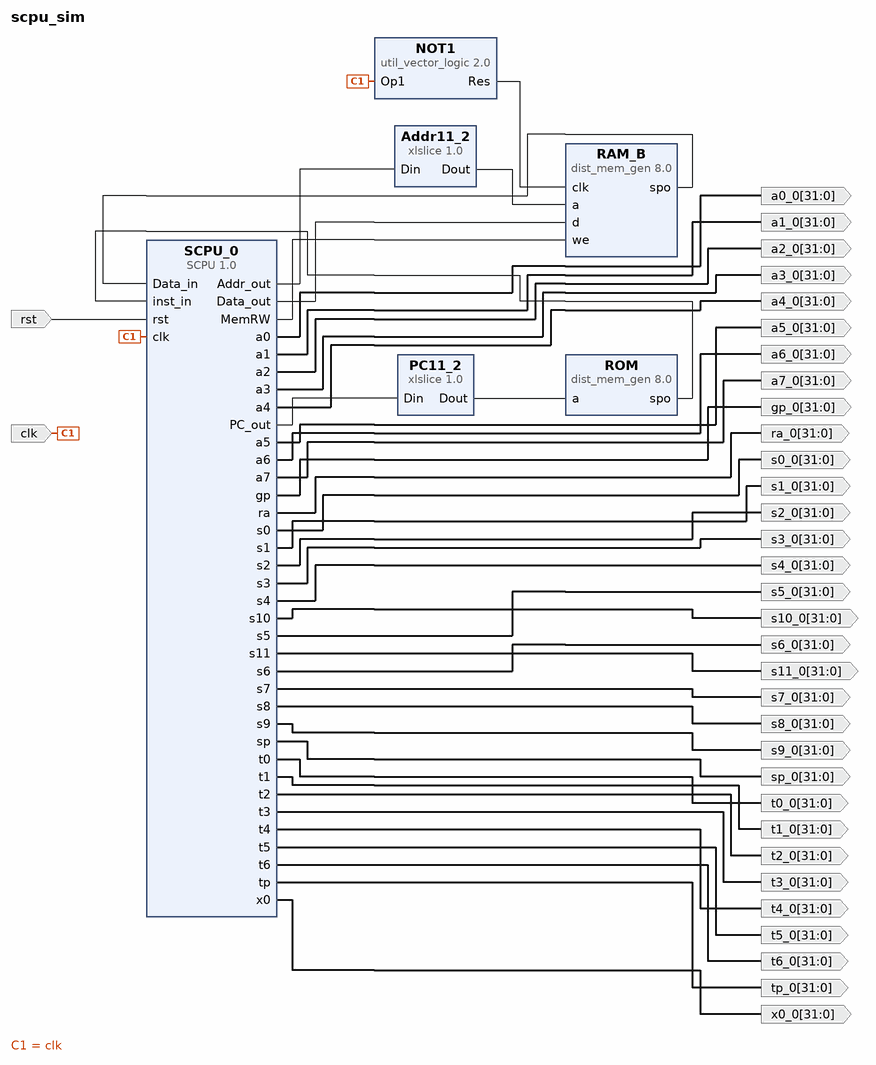
[diagram p0: block diagram of the top level]
# Vivado block design scpu_sim, xc7k160tffg676-2L, Vivado 2017.4
create_bd_design scpu_sim

create_bd_port -dir I -type clk clk
create_bd_port -dir I -type rst rst
create_bd_port -dir O -from 31 -to 0 a0_0
create_bd_port -dir O -from 31 -to 0 a1_0
create_bd_port -dir O -from 31 -to 0 a2_0
create_bd_port -dir O -from 31 -to 0 a3_0
create_bd_port -dir O -from 31 -to 0 a4_0
create_bd_port -dir O -from 31 -to 0 a5_0
create_bd_port -dir O -from 31 -to 0 a6_0
create_bd_port -dir O -from 31 -to 0 a7_0
create_bd_port -dir O -from 31 -to 0 gp_0
create_bd_port -dir O -from 31 -to 0 ra_0
create_bd_port -dir O -from 31 -to 0 s0_0
create_bd_port -dir O -from 31 -to 0 s1_0
create_bd_port -dir O -from 31 -to 0 s10_0
create_bd_port -dir O -from 31 -to 0 s11_0
create_bd_port -dir O -from 31 -to 0 s2_0
create_bd_port -dir O -from 31 -to 0 s3_0
create_bd_port -dir O -from 31 -to 0 s4_0
create_bd_port -dir O -from 31 -to 0 s5_0
create_bd_port -dir O -from 31 -to 0 s6_0
create_bd_port -dir O -from 31 -to 0 s7_0
create_bd_port -dir O -from 31 -to 0 s8_0
create_bd_port -dir O -from 31 -to 0 s9_0
create_bd_port -dir O -from 31 -to 0 sp_0
create_bd_port -dir O -from 31 -to 0 t0_0
create_bd_port -dir O -from 31 -to 0 t1_0
create_bd_port -dir O -from 31 -to 0 t2_0
create_bd_port -dir O -from 31 -to 0 t3_0
create_bd_port -dir O -from 31 -to 0 t4_0
create_bd_port -dir O -from 31 -to 0 t5_0
create_bd_port -dir O -from 31 -to 0 t6_0
create_bd_port -dir O -from 31 -to 0 tp_0
create_bd_port -dir O -from 31 -to 0 x0_0

create_bd_cell -type ip -vlnv xilinx.com:ip:dist_mem_gen:8.0 RAM_B
set_property -dict [list \
  CONFIG.depth 1024 \
  CONFIG.data_width 32 \
  CONFIG.memory_type single_port_ram \
  CONFIG.coefficient_file ../../../../../../../../OExp02-IP2SOC/COE/COE/D_mem.coe \
] [get_bd_cells RAM_B]
create_bd_cell -type ip -vlnv xilinx.com:ip:dist_mem_gen:8.0 ROM
set_property -dict [list \
  CONFIG.depth 1024 \
  CONFIG.data_width 32 \
  CONFIG.memory_type rom \
  CONFIG.coefficient_file ../../../../../../../../OExp02-IP2SOC/COE/I_mem_test.coe \
] [get_bd_cells ROM]
create_bd_cell -type ip -vlnv xilinx.com:ip:xlslice:1.0 Addr11_2
set_property -dict {CONFIG.DIN_TO 2 CONFIG.DIN_FROM 11 CONFIG.DOUT_WIDTH 10} [get_bd_cells Addr11_2]
create_bd_cell -type ip -vlnv xilinx.com:ip:xlslice:1.0 PC11_2
set_property -dict {CONFIG.DIN_TO 2 CONFIG.DIN_FROM 11 CONFIG.DOUT_WIDTH 10} [get_bd_cells PC11_2]
create_bd_cell -type ip -vlnv xilinx.com:ip:util_vector_logic:2.0 NOT1
set_property -dict {CONFIG.C_SIZE 1 CONFIG.C_OPERATION not} [get_bd_cells NOT1]
create_bd_cell -type ip -vlnv xilinx.com:user:SCPU:1.0 SCPU_0

# ---- connections ----

connect_bd_net -net clk_0_1 [get_bd_ports clk] [get_bd_pins NOT1/Op1] [get_bd_pins SCPU_0/clk]
connect_bd_net [get_bd_pins NOT1/Res] [get_bd_pins RAM_B/clk]
connect_bd_net [get_bd_pins PC11_2/Dout] [get_bd_pins ROM/a]
connect_bd_net [get_bd_pins Addr11_2/Dout] [get_bd_pins RAM_B/a]
connect_bd_net [get_bd_pins ROM/spo] [get_bd_pins SCPU_0/inst_in]
connect_bd_net [get_bd_pins RAM_B/spo] [get_bd_pins SCPU_0/Data_in]
connect_bd_net [get_bd_ports rst] [get_bd_pins SCPU_0/rst]
connect_bd_net [get_bd_pins SCPU_0/PC_out] [get_bd_pins PC11_2/Din]
connect_bd_net [get_bd_pins SCPU_0/Addr_out] [get_bd_pins Addr11_2/Din]
connect_bd_net [get_bd_pins SCPU_0/Data_out] [get_bd_pins RAM_B/d]
connect_bd_net [get_bd_pins SCPU_0/MemRW] [get_bd_pins RAM_B/we]
connect_bd_net [get_bd_pins SCPU_0/a0] [get_bd_ports a0_0]
connect_bd_net [get_bd_pins SCPU_0/a1] [get_bd_ports a1_0]
connect_bd_net [get_bd_pins SCPU_0/a2] [get_bd_ports a2_0]
connect_bd_net [get_bd_pins SCPU_0/a3] [get_bd_ports a3_0]
connect_bd_net [get_bd_pins SCPU_0/a4] [get_bd_ports a4_0]
connect_bd_net [get_bd_pins SCPU_0/a5] [get_bd_ports a5_0]
connect_bd_net [get_bd_pins SCPU_0/a6] [get_bd_ports a6_0]
connect_bd_net [get_bd_pins SCPU_0/a7] [get_bd_ports a7_0]
connect_bd_net [get_bd_pins SCPU_0/gp] [get_bd_ports gp_0]
connect_bd_net [get_bd_pins SCPU_0/ra] [get_bd_ports ra_0]
connect_bd_net [get_bd_pins SCPU_0/s0] [get_bd_ports s0_0]
connect_bd_net [get_bd_pins SCPU_0/s1] [get_bd_ports s1_0]
connect_bd_net [get_bd_pins SCPU_0/s10] [get_bd_ports s10_0]
connect_bd_net [get_bd_pins SCPU_0/s11] [get_bd_ports s11_0]
connect_bd_net [get_bd_pins SCPU_0/s2] [get_bd_ports s2_0]
connect_bd_net [get_bd_pins SCPU_0/s3] [get_bd_ports s3_0]
connect_bd_net [get_bd_pins SCPU_0/s4] [get_bd_ports s4_0]
connect_bd_net [get_bd_pins SCPU_0/s5] [get_bd_ports s5_0]
connect_bd_net [get_bd_pins SCPU_0/s6] [get_bd_ports s6_0]
connect_bd_net [get_bd_pins SCPU_0/s7] [get_bd_ports s7_0]
connect_bd_net [get_bd_pins SCPU_0/s8] [get_bd_ports s8_0]
connect_bd_net [get_bd_pins SCPU_0/s9] [get_bd_ports s9_0]
connect_bd_net [get_bd_pins SCPU_0/sp] [get_bd_ports sp_0]
connect_bd_net [get_bd_pins SCPU_0/t0] [get_bd_ports t0_0]
connect_bd_net [get_bd_pins SCPU_0/t1] [get_bd_ports t1_0]
connect_bd_net [get_bd_pins SCPU_0/t2] [get_bd_ports t2_0]
connect_bd_net [get_bd_pins SCPU_0/t3] [get_bd_ports t3_0]
connect_bd_net [get_bd_pins SCPU_0/t4] [get_bd_ports t4_0]
connect_bd_net [get_bd_pins SCPU_0/t5] [get_bd_ports t5_0]
connect_bd_net [get_bd_pins SCPU_0/t6] [get_bd_ports t6_0]
connect_bd_net [get_bd_pins SCPU_0/tp] [get_bd_ports tp_0]
connect_bd_net [get_bd_pins SCPU_0/x0] [get_bd_ports x0_0]

validate_bd_design
save_bd_design
